# Altium schematic sheet rf_bms__.SchDoc
size A3
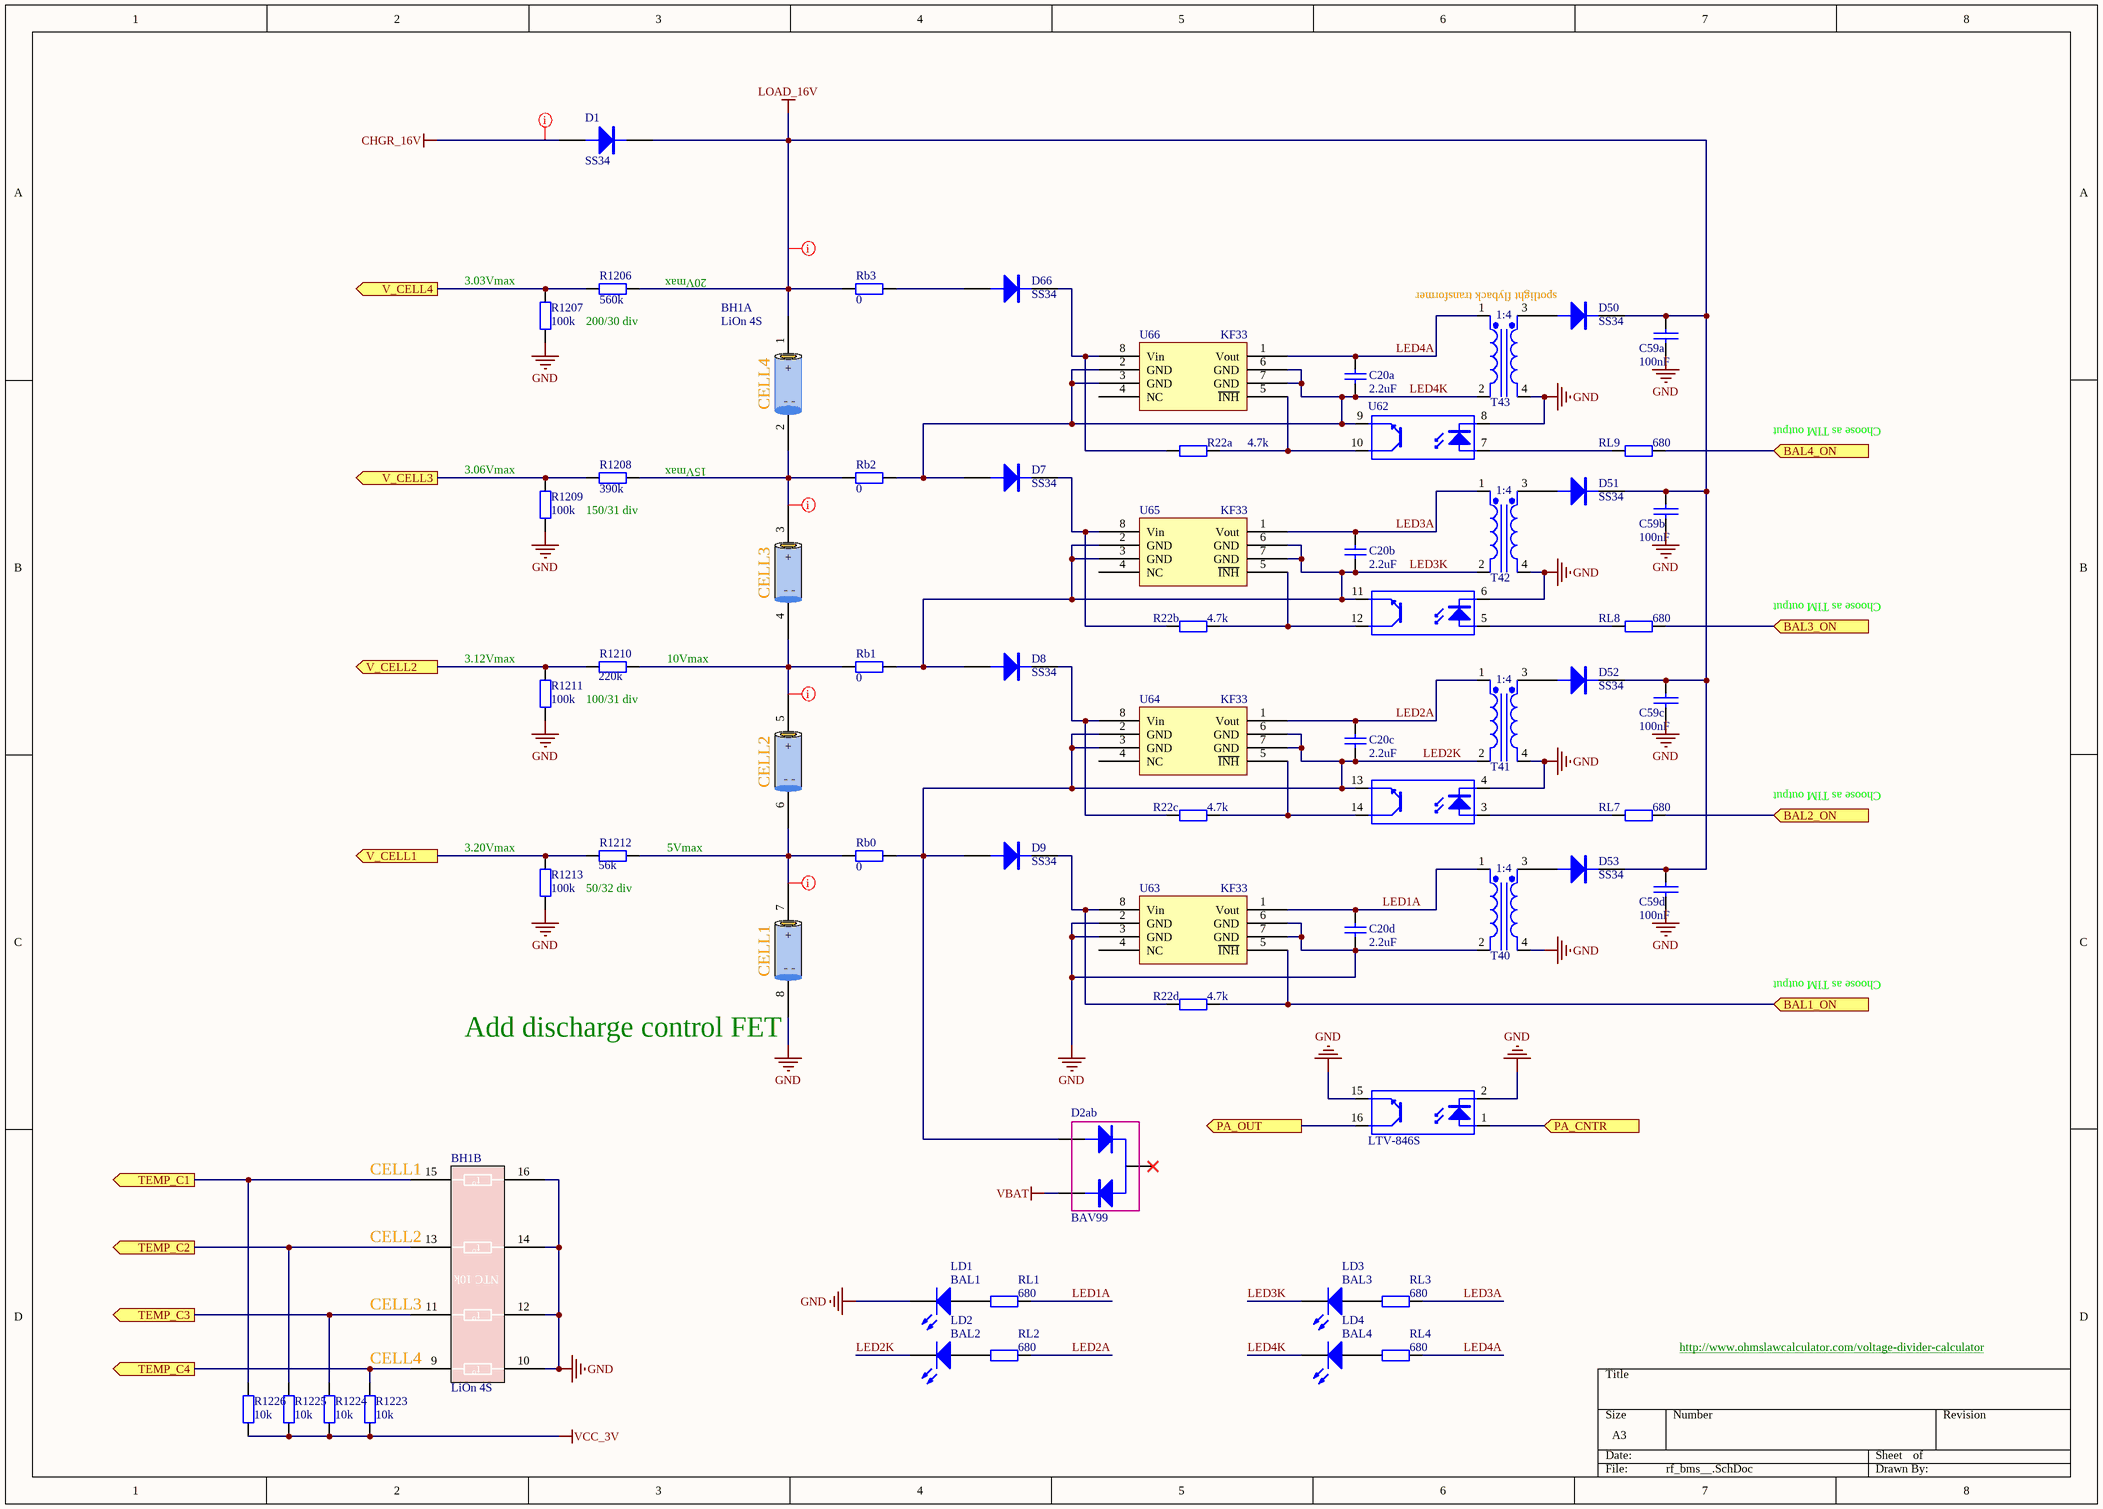
[diagram p0: rf_bms__.SchDoc]

## Parts
BH1  LiOn 4S  [BATT_HOLDER]  (parts A,B of 2)
C20a  2.2uF  [0805]
C20b  2.2uF  [0805]
C20c  2.2uF  [0805]
C20d  2.2uF  [0805]
C59a  100nF  [0805]
C59b  100nF  [0805]
C59c  100nF  [0805]
C59d  100nF  [0805]
D1  SS34  [SOD87]
D2ab  BAV99  [SOT-23]
D7  SS34  [SOD87]
D8  SS34  [SOD87]
D9  SS34  [SOD87]
D50  SS34  [SOD87]
D51  SS34  [SOD87]
D52  SS34  [SOD87]
D53  SS34  [SOD87]
D66  SS34  [SOD87]
LD1  BAL1  [0805_led]  (no BOM)
LD2  BAL2  [0805_led]  (no BOM)
LD3  BAL3  [0805_led]  (no BOM)
LD4  BAL4  [0805_led]  (no BOM)
R22a  4.7k  [0805]
R22b  4.7k  [0805]
R22c  4.7k  [0805]
R22d  4.7k  [0805]
R1206  560k  [0805]
R1207  100k  [0805]
R1208  390k  [0805]
R1209  100k  [0805]
R1210  220k  [0805]
R1211  100k  [0805]
R1212  56k  [0805]
R1213  100k  [0805]
R1223  10k  [0805]
R1224  10k  [0805]
R1225  10k  [0805]
R1226  10k  [0805]
Rb0  0  [0805]
Rb1  0  [0805]
Rb2  0  [0805]
Rb3  0  [0805]
RL1  680  [0805]
RL2  680  [0805]
RL3  680  [0805]
RL4  680  [0805]
RL7  680  [0805]
RL8  680  [0805]
RL9  680  [0805]
T40  1:4  [FB_TR]
T41  1:4  [FB_TR]
T42  1:4  [FB_TR]
T43  1:4  [FB_TR]
U62  LTV-846S  [SMDIP-8]
U63  KF33  [SO-8]
U64  KF33  [SO-8]
U65  KF33  [SO-8]
U66  KF33  [SO-8]

## Ports
BAL1_ON (in), BAL2_ON (in), BAL3_ON (in), BAL4_ON (in), PA_CNTR (in), PA_OUT (out), TEMP_C1 (out), TEMP_C2 (out), TEMP_C3 (out), TEMP_C4 (out), V_CELL1 (out), V_CELL2 (out), V_CELL3 (out), V_CELL4 (out)

## Nets
CHGR_16V: D1.1(A)
GND: BH1.8(|) BH1.10 BH1.12 BH1.14 BH1.16 C20d.1 C59a.2 C59b.2 C59c.2 C59d.2 LD1.2(K) R1207.2 R1209.2 R1211.2 R1213.2 T40.2(Pri-) T40.4(Sec-) T41.4(Sec-) T42.4(Sec-) T43.4(Sec-) U62.2(K) U62.4(K) U62.6(K) U62.8(K) U62.15(E) U63.2(GND) U63.3(GND) U63.6(GND) U63.7(GND)
LOAD_16V: BH1.1(+) C59a.1 C59b.1 C59c.1 C59d.1 D1.2(K) D50.2(K) D51.2(K) D52.2(K) D53.2(K) R1206.1 Rb3.2
VBAT: D2ab.2(K1)
VCC_3V: R1223.1 R1224.1 R1225.1 R1226.1
BAL1_ON: R22d.1 U63.5(~{INH}) ; port BAL1_ON
BAL2_ON: RL7.1 ; port BAL2_ON
BAL3_ON: RL8.1 ; port BAL3_ON
BAL4_ON: RL9.1 ; port BAL4_ON
LED1A: C20d.2 RL1.1 T40.1(Pri+) U63.1(Vout)
LED2A: C20c.2 RL2.1 T41.1(Pri+) U64.1(Vout)
LED2K: C20c.1 D2ab.1(A1) D9.1(A) LD2.2(K) Rb0.1 T41.2(Pri-) U62.13(E) U64.2(GND) U64.3(GND) U64.6(GND) U64.7(GND)
LED3A: C20b.2 RL3.1 T42.1(Pri+) U65.1(Vout)
LED3K: C20b.1 D8.1(A) LD3.2(K) Rb1.1 T42.2(Pri-) U62.11(E) U65.2(GND) U65.3(GND) U65.6(GND) U65.7(GND)
LED4A: C20a.2 RL4.1 T43.1(Pri+) U66.1(Vout)
LED4K: C20a.1 D7.1(A) LD4.2(K) Rb2.1 T43.2(Pri-) U62.9(E) U66.2(GND) U66.3(GND) U66.6(GND) U66.7(GND)
PA_CNTR: U62.1(A) ; port PA_CNTR
PA_OUT: U62.16(C) ; port PA_OUT
TEMP_C1: BH1.15 R1226.2 ; port TEMP_C1
TEMP_C2: BH1.13 R1225.2 ; port TEMP_C2
TEMP_C3: BH1.11 R1224.2 ; port TEMP_C3
TEMP_C4: BH1.9 R1223.2 ; port TEMP_C4
V_CELL1: R1212.2 R1213.1 ; port V_CELL1
V_CELL2: R1210.2 R1211.1 ; port V_CELL2
V_CELL3: R1208.1 R1209.1 ; port V_CELL3
V_CELL4: R1206.2 R1207.1 ; port V_CELL4
NetBH1_2: BH1.2(|) BH1.3(+) R1208.2 Rb2.2
NetBH1_4: BH1.4(|) BH1.5(+) R1210.1 Rb1.2
NetBH1_6: BH1.6(|) BH1.7(+) R1212.1 Rb0.2
NetD7_2: D7.2(K) R22b.2 U65.8(Vin)
NetD8_2: D8.2(K) R22c.2 U64.8(Vin)
NetD9_2: D9.2(K) R22d.2 U63.8(Vin)
NetD50_1: D50.1(A) T43.3(Sec+)
NetD51_1: D51.1(A) T42.3(Sec+)
NetD52_1: D52.1(A) T41.3(Sec+)
NetD53_1: D53.1(A) T40.3(Sec+)
NetD66_1: D66.1(A) Rb3.1
NetD66_2: D66.2(K) R22a.2 U66.8(Vin)
NetLD1_1: LD1.1(A) RL1.2
NetLD2_1: LD2.1(A) RL2.2
NetLD3_1: LD3.1(A) RL3.2
NetLD4_1: LD4.1(A) RL4.2
NetR22a_1: R22a.1 U62.10(C) U66.5(~{INH})
NetR22b_1: R22b.1 U62.12(C) U65.5(~{INH})
NetR22c_1: R22c.1 U62.14(C) U64.5(~{INH})
NetRL7_2: RL7.2 U62.3(A)
NetRL8_2: RL8.2 U62.5(A)
NetRL9_2: RL9.2 U62.7(A)

Not connected (* = marked no-connect by the designer): D2ab 3(C)*; U63 4(NC); U64 4(NC); U65 4(NC); U66 4(NC)

## Layout directives
rule Width Constraint [Pref Width = 80mil    Min Width = 80mil    Max Width = 80mil]: CHGR_16V, LOAD_16V, NetBH1_2, NetBH1_4, NetBH1_6

## Notes on the sheet
- (near R1207) 3.03Vmax
- (near R1206) 20Vmax
- spotlight flyback transformer
- 200/30 div
- (near BH1) CELL4
- Choose as TIM output
- (near R1209) 3.06Vmax
- 150/31 div
- (near R1208) 15Vmax
- (near BH1) CELL3
- (near R1211) 3.12Vmax
- 100/31 div
- (near R1210) 10Vmax
- (near BH1) CELL2
- (near R1213) 3.20Vmax
- (near R1212) 5Vmax
- 50/32 div
- (near BH1) CELL1
- (near BH1) Add discharge control FET
- CELL4
- http://www.ohmslawcalculator.com/voltage-divider-calculator
- (in symbol BATT_HOLDER, part B) t°; NTC 10k

## Library data of the parts
BH1 = BATT_HOLDER: LiOn 18650 4S Holder
C20a C20b C20c C20d = CAP: Capacitor; Value: 100nF; Published: 8-Jun-2000; Revision: July-2002: Re-released for DXP Platform.; Publisher: Altium Limited
C59a C59b C59c C59d = CAP: Capacitor; Order: FN 252-2090; Voltage: 100V; QT Order: QCC-00154; Price: 0.068
D1 D7-D9 D50-D53 D66 = PMEG6010CEH: DIODE, SCHOTTKY, 1A, 60V, SOD-123F; Order: FN 151-0694; QT Order: QCD-00034; Price: 0.085
D2ab = BAV99: Small Signal Diode, Dual Series; Order: FN 162-1837; Price: 0.0618
LD1-LD4 = LED2: LED 3mm; QT Order: QCD-00052; Revision: July-2002: Re-released for DXP Platform.; Price: 0.116
R22a R22b R22c R22d R1206-R1213 R1223-R1226 Rb0-Rb3 = RES: Resistor; Order: FN 933-3681; QT Order: QCR-00268; Price: 0.009
RL1-RL4 RL7-RL9 = RES: Resistor; Order: FN 146-9857; Price: 0.046
T40-T43 = FB_TR: Flyback transformer 1:4; Order: EB 291023830340; Price: 0.534
U62 = QUAD_OPTO: Quad Opto Coupler
U63-U66 = KF50: 5V regulator with inhibit